# EAGLE schematic untitled (EAGLE 6.3)

## Sheet 1 of 2: DSPL
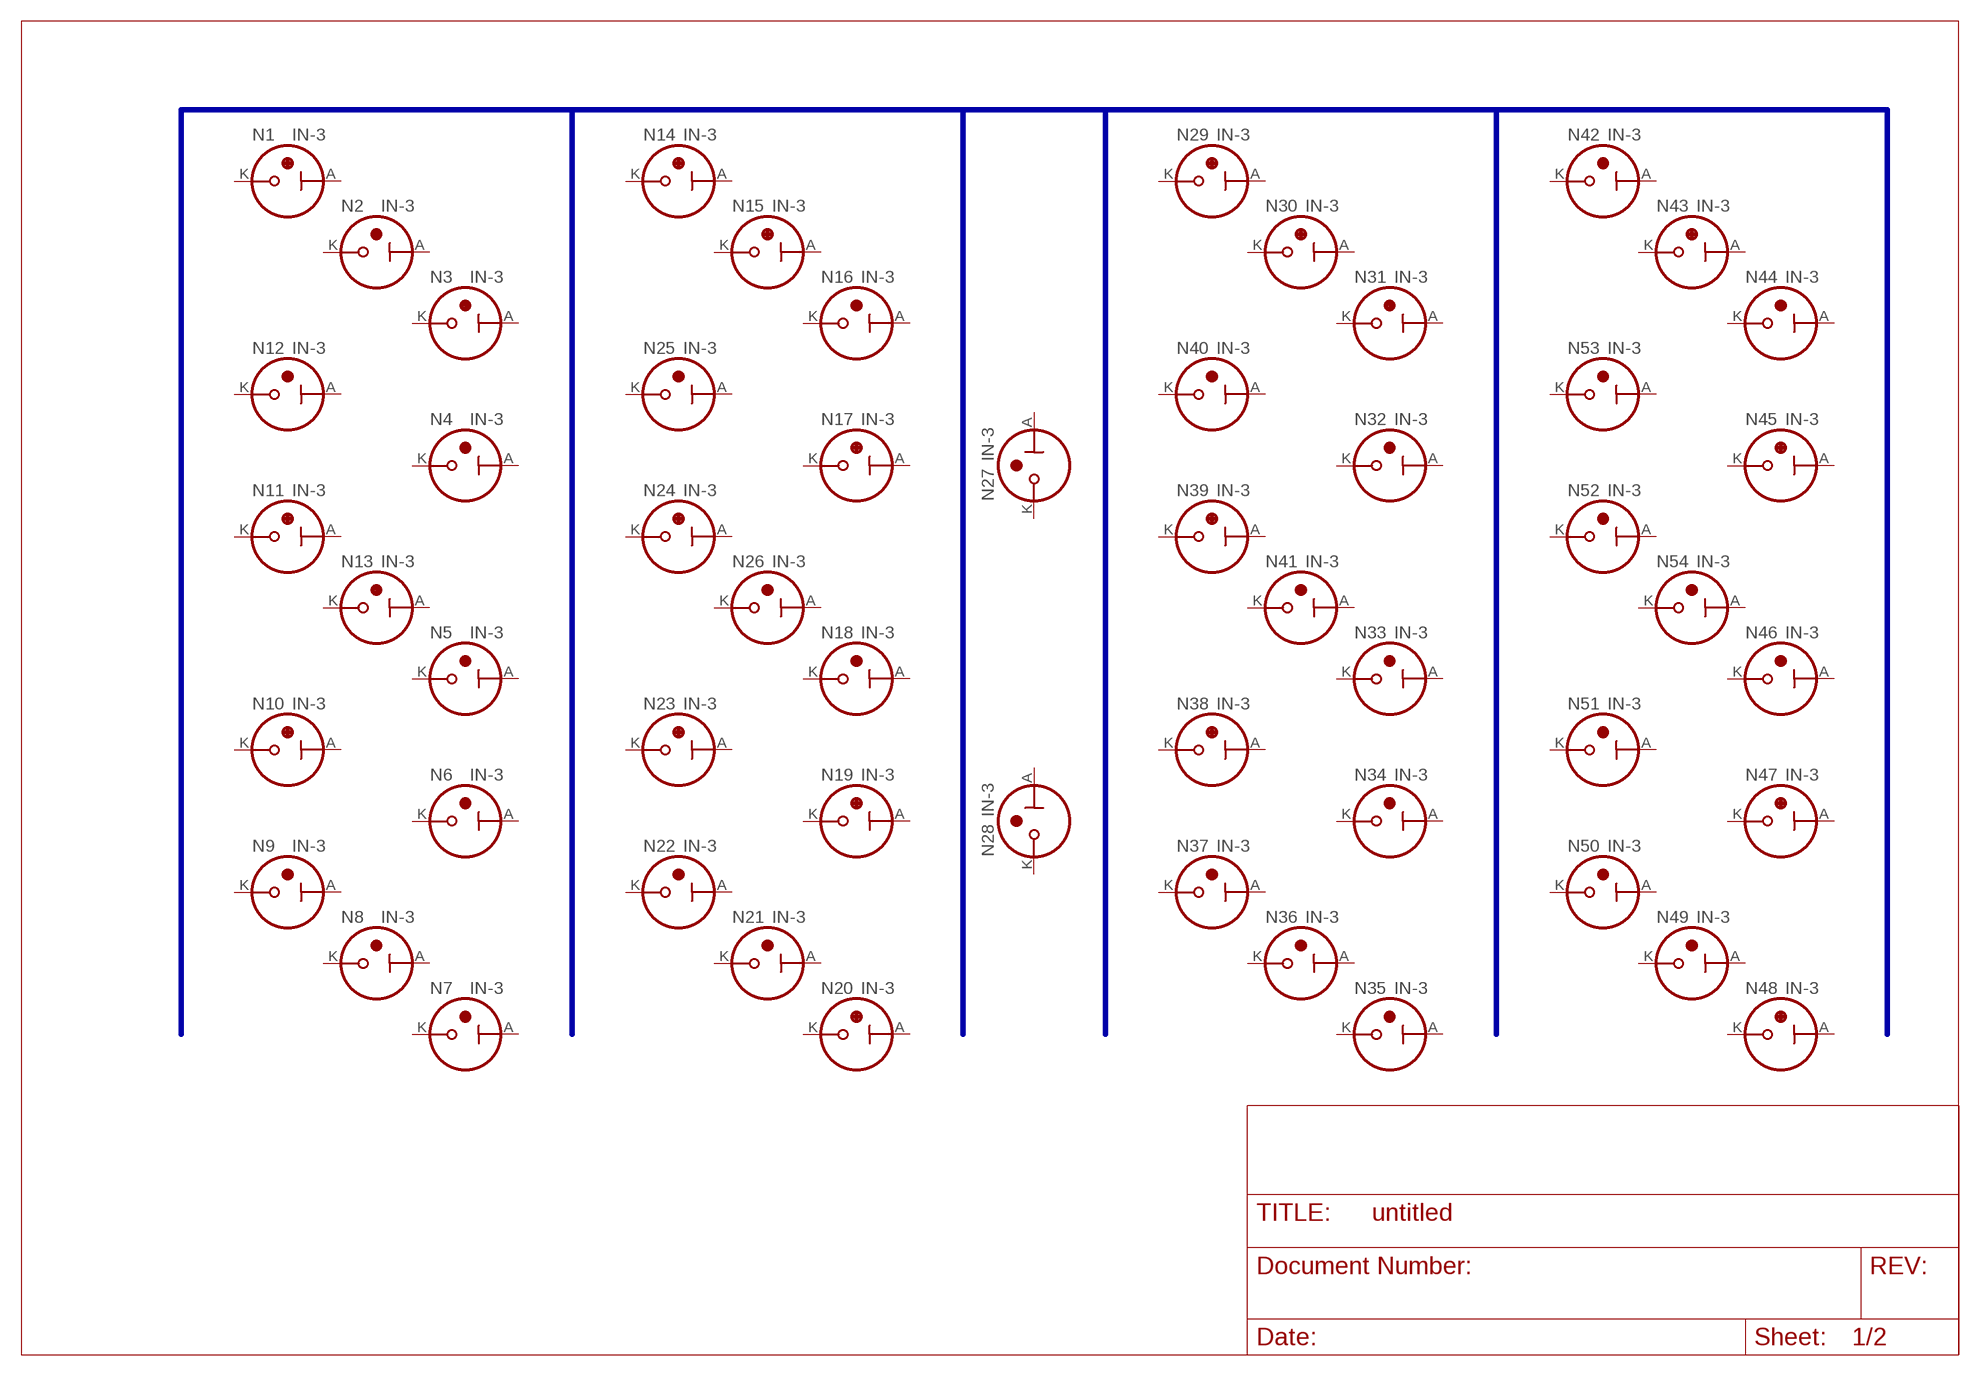
[diagram p0: schematic, sheet 1]

### Parts
N1  IN-3  [IN-3]
N2  IN-3  [IN-3]
N3  IN-3  [IN-3]
N4  IN-3  [IN-3]
N5  IN-3  [IN-3]
N6  IN-3  [IN-3]
N7  IN-3  [IN-3]
N8  IN-3  [IN-3]
N9  IN-3  [IN-3]
N10  IN-3  [IN-3]
N11  IN-3  [IN-3]
N12  IN-3  [IN-3]
N13  IN-3  [IN-3]
N14  IN-3  [IN-3]
N15  IN-3  [IN-3]
N16  IN-3  [IN-3]
N17  IN-3  [IN-3]
N18  IN-3  [IN-3]
N19  IN-3  [IN-3]
N20  IN-3  [IN-3]
N21  IN-3  [IN-3]
N22  IN-3  [IN-3]
N23  IN-3  [IN-3]
N24  IN-3  [IN-3]
N25  IN-3  [IN-3]
N26  IN-3  [IN-3]
N27  IN-3  [IN-3]
N28  IN-3  [IN-3]
N29  IN-3  [IN-3]
N30  IN-3  [IN-3]
N31  IN-3  [IN-3]
N32  IN-3  [IN-3]
N33  IN-3  [IN-3]
N34  IN-3  [IN-3]
N35  IN-3  [IN-3]
N36  IN-3  [IN-3]
N37  IN-3  [IN-3]
N38  IN-3  [IN-3]
N39  IN-3  [IN-3]
N40  IN-3  [IN-3]
N41  IN-3  [IN-3]
N42  IN-3  [IN-3]
N43  IN-3  [IN-3]
N44  IN-3  [IN-3]
N45  IN-3  [IN-3]
N46  IN-3  [IN-3]
N47  IN-3  [IN-3]
N48  IN-3  [IN-3]
N49  IN-3  [IN-3]
N50  IN-3  [IN-3]
N51  IN-3  [IN-3]
N52  IN-3  [IN-3]
N53  IN-3  [IN-3]
N54  IN-3  [IN-3]
Unconnected: N1.A N1.K N2.A N2.K N3.A N3.K N4.A N4.K N5.A N5.K N6.A N6.K N7.A N7.K N8.A N8.K N9.A N9.K N10.A N10.K N11.A N11.K N12.A N12.K N13.A N13.K N14.A N14.K N15.A N15.K N16.A N16.K N17.A N17.K N18.A N18.K N19.A N19.K N20.A N20.K N21.A N21.K N22.A N22.K N23.A N23.K N24.A N24.K N25.A N25.K N26.A N26.K N27.A N27.K N28.A N28.K N29.A N29.K N30.A N30.K N31.A N31.K N32.A N32.K N33.A N33.K N34.A N34.K N35.A N35.K N36.A N36.K N37.A N37.K N38.A N38.K N39.A N39.K N40.A N40.K N41.A N41.K N42.A N42.K N43.A N43.K N44.A N44.K N45.A N45.K N46.A N46.K N47.A N47.K N48.A N48.K N49.A N49.K N50.A N50.K N51.A N51.K N52.A N52.K N53.A N53.K N54.A N54.K

### Buses
B$1

## Sheet 2 of 2: MCU
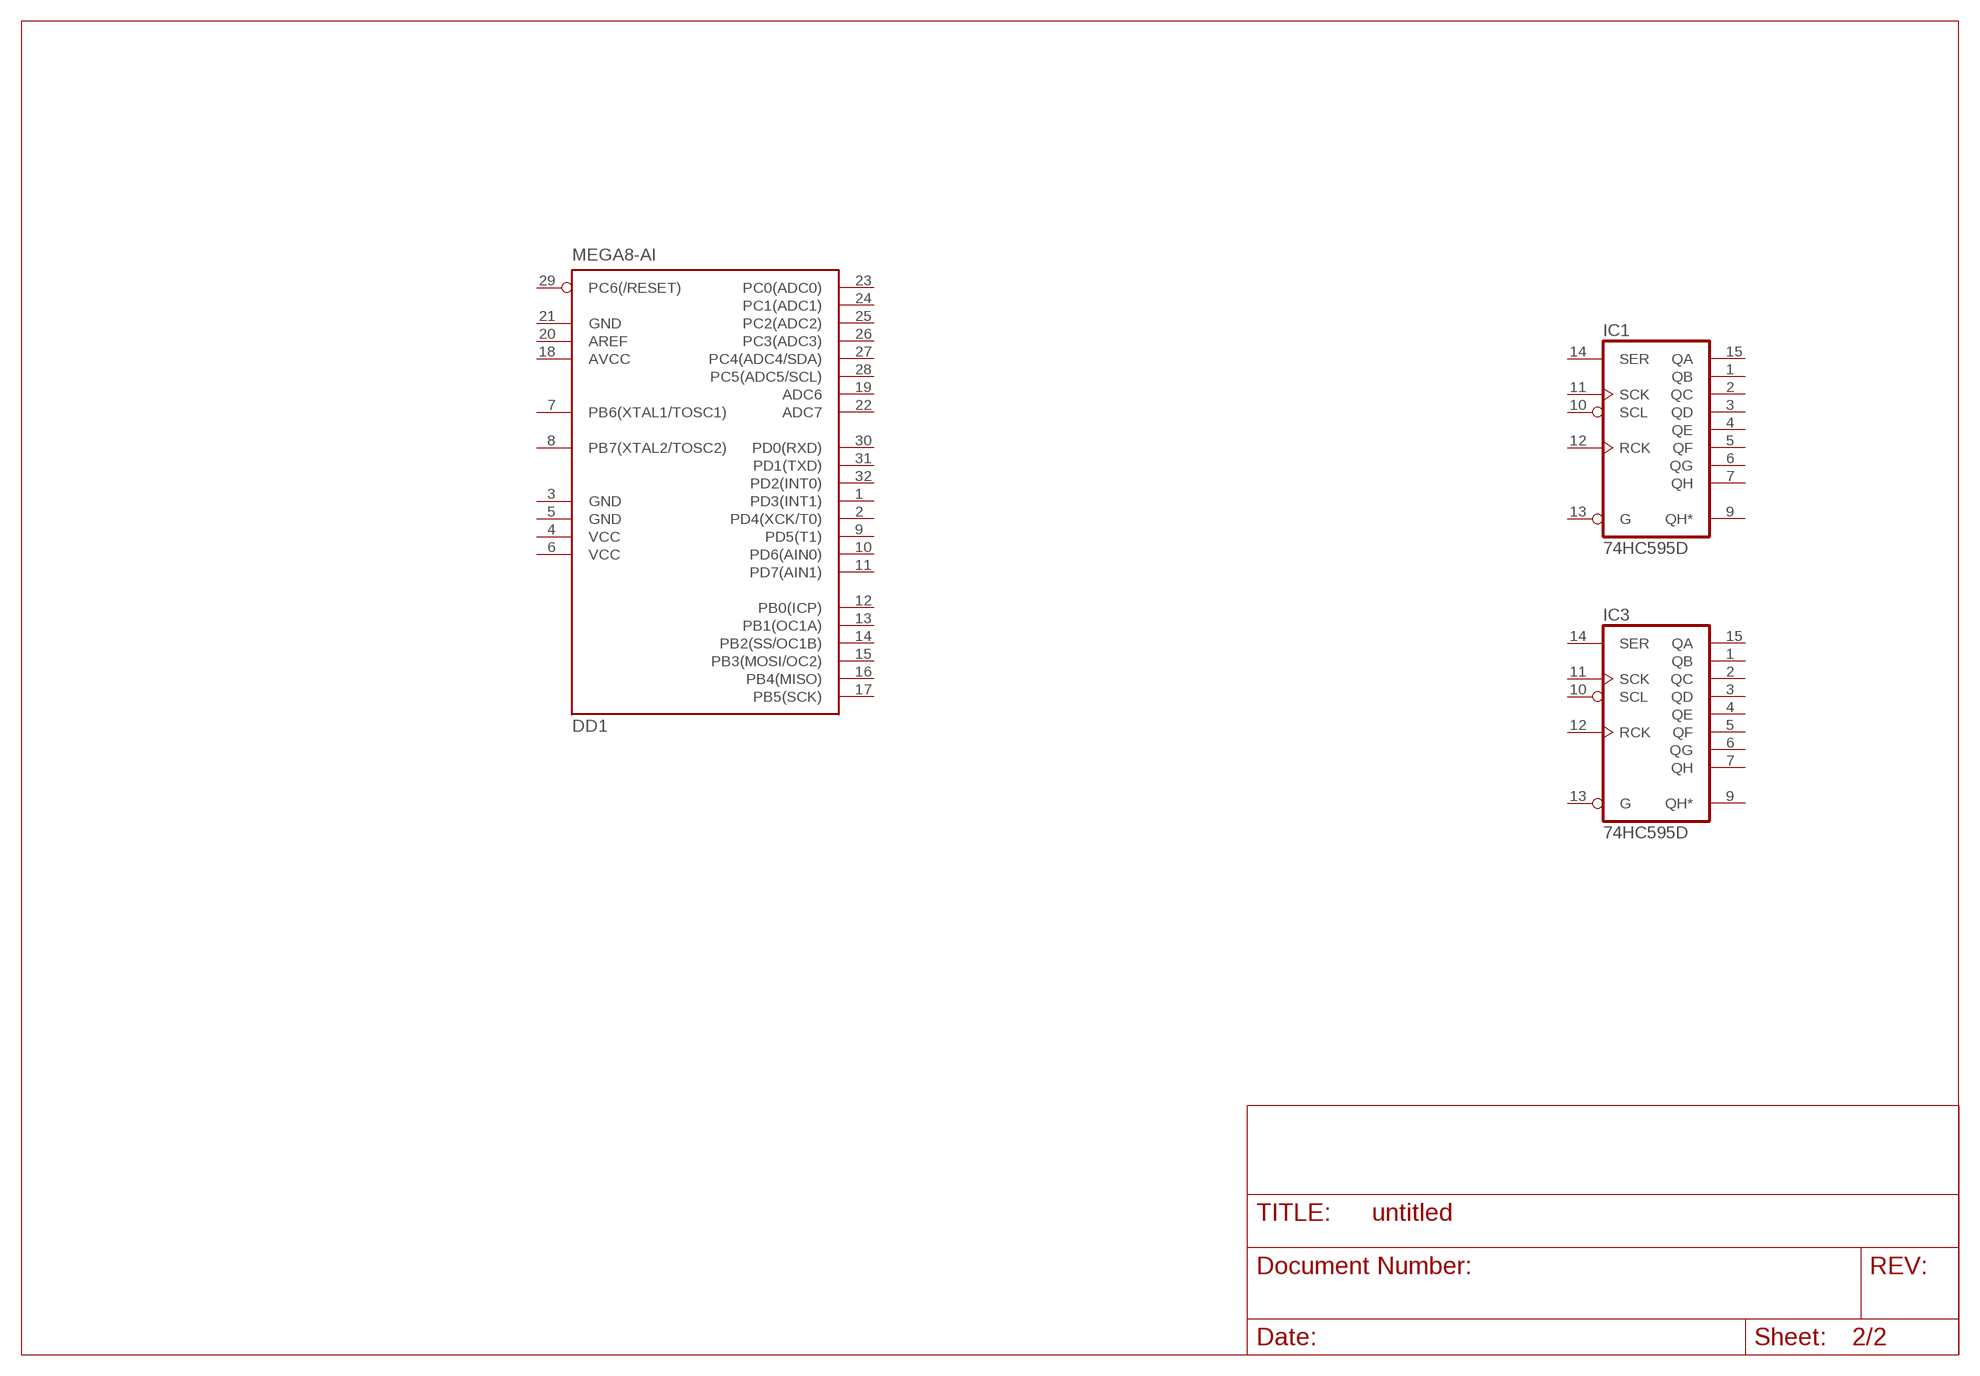
[diagram p1: schematic, sheet 2]

### Parts
DD1  MEGA8-AI  [TQFP32-08]
IC1  74HC595D  [SO16]
IC3  74HC595D  [SO16]
Unconnected: DD1.1(PD3(INT1)) DD1.2(PD4(XCK/T0)) DD1.7(PB6(XTAL1/TOSC1)) DD1.8(PB7(XTAL2/TOSC2)) DD1.9(PD5(T1)) DD1.10(PD6(AIN0)) DD1.11(PD7(AIN1)) DD1.12(PB0(ICP)) DD1.13(PB1(OC1A)) DD1.14(PB2(SS/OC1B)) DD1.15(PB3(MOSI/OC2)) DD1.16(PB4(MISO)) DD1.17(PB5(SCK)) DD1.19(ADC6) DD1.20(AREF) DD1.22(ADC7) DD1.23(PC0(ADC0)) DD1.24(PC1(ADC1)) DD1.25(PC2(ADC2)) DD1.26(PC3(ADC3)) DD1.27(PC4(ADC4/SDA)) DD1.28(PC5(ADC5/SCL)) DD1.29(PC6(/RESET)) DD1.30(PD0(RXD)) DD1.31(PD1(TXD)) DD1.32(PD2(INT0)) IC1.1(QB) IC1.2(QC) IC1.3(QD) IC1.4(QE) IC1.5(QF) IC1.6(QG) IC1.7(QH) IC1.9(QH*) IC1.10(SCL) IC1.11(SCK) IC1.12(RCK) IC1.13(G) IC1.14(SER) IC1.15(QA) IC3.1(QB) IC3.2(QC) IC3.3(QD) IC3.4(QE) IC3.5(QF) IC3.6(QG) IC3.7(QH) IC3.9(QH*) IC3.10(SCL) IC3.11(SCK) IC3.12(RCK) IC3.13(G) IC3.14(SER) IC3.15(QA)

## Power pins joined to a net without a drawn wire
AVCC: DD1.18(AVCC)
GND: DD1.3(GND) DD1.5(GND) DD1.21(GND) IC1.8(GND) IC3.8(GND)
VCC: DD1.4(VCC) DD1.6(VCC) IC1.16(VCC) IC3.16(VCC)

## Library data of the parts
DD1 = atmel:MEGA8: MICROCONTROLLER 8 Kbytes FLASH, 1 kbytes SRAM, 512 bytes EEPROM, USART, 6-channel 10 bit ADC, 2-channel 8 bit ADC Pin compatible with Atmega48, ATMega88, ATMega168 Source: avr.lbr; MPN: ATMEGA8-16AU; OC_FARNELL: 9171371; OC_NEWARK: 73M8863
IC1 IC3 = 74xx-eu:74*595: 8-bit SHIFT REGISTER, output latch
N1-N54 = in3:IN-3: IN-3: nixie bulb